# EasyEDA schematic 1-Schematic_testgarden.json
TITLE: moister; REV: 1.0; Date: 2021-08-10; Sheet: 1/1; Drawn By: Jack E; Company: Your Company
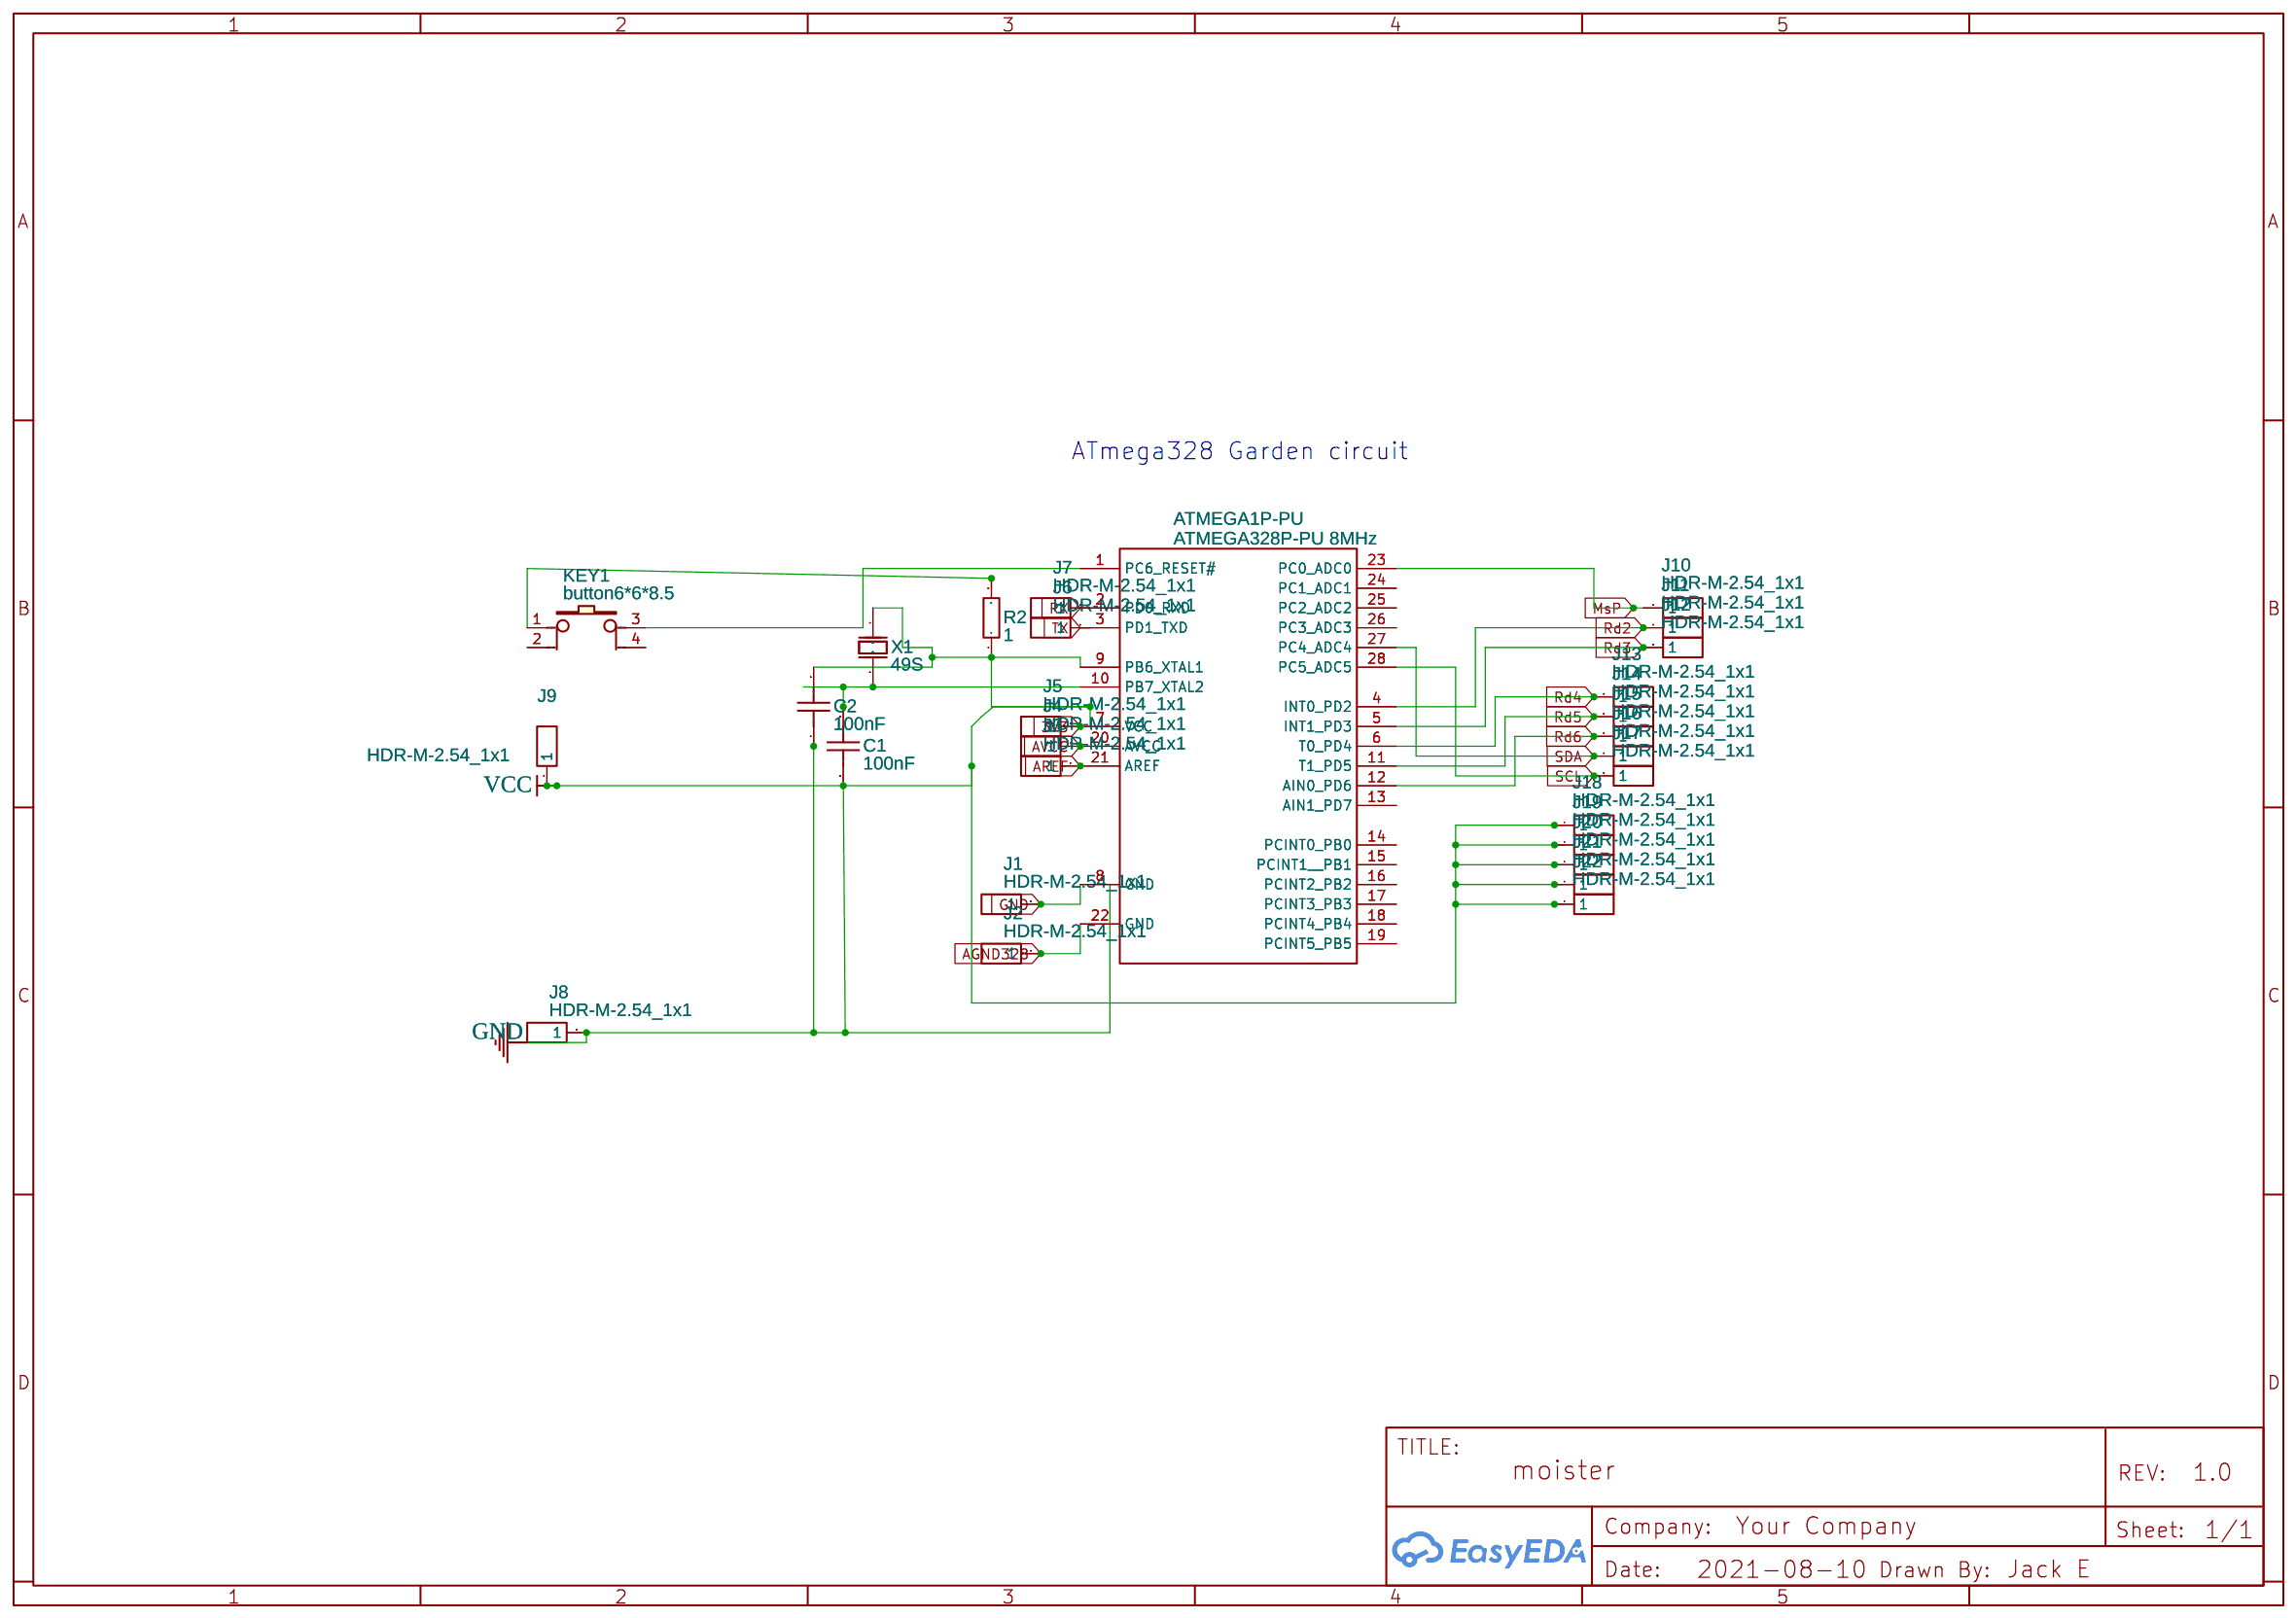
[diagram p0: schematic sheet]

## Parts
ATMEGA1P-PU  ATMEGA328P-PU 8MHz  [ATMEGA328P]
C1  100nF  [CAP-TH_L5.0-W4.0-P5.00-D1.0]
C2  100nF  [CAP-TH_L5.0-W4.0-P5.00-D1.0]
J1  HDR-M-2.54_1x1  [HDR-M-2.54_1X1]
J2  HDR-M-2.54_1x1  [HDR-M-2.54_1X1]
J3  HDR-M-2.54_1x1  [HDR-M-2.54_1X1]
J4  HDR-M-2.54_1x1  [HDR-M-2.54_1X1]
J5  HDR-M-2.54_1x1  [HDR-M-2.54_1X1]
J6  HDR-M-2.54_1x1  [HDR-M-2.54_1X1]
J7  HDR-M-2.54_1x1  [HDR-M-2.54_1X1]
J8  HDR-M-2.54_1x1  [HDR-M-2.54_1X1]
J9  HDR-M-2.54_1x1  [HDR-M-2.54_1X1]
J10  HDR-M-2.54_1x1  [HDR-M-2.54_1X1]
J11  HDR-M-2.54_1x1  [HDR-M-2.54_1X1]
J12  HDR-M-2.54_1x1  [HDR-M-2.54_1X1]
J13  HDR-M-2.54_1x1  [HDR-M-2.54_1X1]
J14  HDR-M-2.54_1x1  [HDR-M-2.54_1X1]
J15  HDR-M-2.54_1x1  [HDR-M-2.54_1X1]
J16  HDR-M-2.54_1x1  [HDR-M-2.54_1X1]
J17  HDR-M-2.54_1x1  [HDR-M-2.54_1X1]
J18  HDR-M-2.54_1x1  [HDR-M-2.54_1X1]
J19  HDR-M-2.54_1x1  [HDR-M-2.54_1X1]
J20  HDR-M-2.54_1x1  [HDR-M-2.54_1X1]
J21  HDR-M-2.54_1x1  [HDR-M-2.54_1X1]
J22  HDR-M-2.54_1x1  [HDR-M-2.54_1X1]
KEY1  button6*6*8.5  [KEY-TH_4P-L6.0-W6.0-P4.50]
R2  1  [RES-TH_BD4.5-L11.0-P15.00-D0.7]
X1  49S  [HC-49S_L11.0-W4.4-P4.88]

## Library data of the parts
ATMEGA1P-PU = ATMEGA328P-PU: sourceId: Oic6oiASL; Supplier: LCSC; Manufacturer: MICROCHIP; image: //image.lceda.cn/szlcsc/C33901.jpg; Contributor: waltertayler; Supplier Part: C33901
C1 C2 = CT4G-0805-2X1-63V-0.1μF-K: Supplier: LCSC; Supplier Part: C400087; Manufacturer: 火炬; Contributor: LCSC; JLCPCB Part Class: Extended Part
J1-J22 = HDR-M-2.54_1x1: Supplier Part: C81276; Supplier: LCSC; Contributor: LCEDA_Lib
KEY1 = button6*6*8.5: Supplier Part: C59980; Supplier: LCSC; Manufacturer: ReliaPro
R2 = EWWR0001J1R00T9: Supplier: LCSC; Supplier Part: C348836; Manufacturer: ResistorToday; Contributor: LCSC; JLCPCB Part Class: Extended Part
X1 = 49S DIP Crystal insulation film: Supplier: LCSC; Manufacturer: YXC; Supplier Part: C35018

## Nets
3V3: ATMEGA1P-PU.7(VCC) J5.1
AGND328: ATMEGA1P-PU.22(GND) J2.1
AVCC: ATMEGA1P-PU.20(AVCC) J4.1
GND: ATMEGA1P-PU.8(GND) ATMEGA1P-PU.9(PB6 XTAL1) C1.1 C2.1 C2.2 J1.1 J8.1 J9.1 J18.1 J19.1 J20.1 J21.1 J22.1 R2.1 X1.1(OSC1)
AREF: ATMEGA1P-PU.21(AREF) J3.1
MsP: ATMEGA1P-PU.23(PC0 ADC0) J10.1
Rd2: ATMEGA1P-PU.4(INT0 PD2) J11.1
Rd3: ATMEGA1P-PU.5(INT1 PD3) J12.1
Rd4: ATMEGA1P-PU.6(T0 PD4) J13.1
Rd5: ATMEGA1P-PU.11(T1 PD5) J14.1
Rd6: ATMEGA1P-PU.12(AIN0 PD6) J15.1
RX: ATMEGA1P-PU.2(PD0 RXD)
SCL: ATMEGA1P-PU.28(PC5 ADC5) J17.1
SDA: ATMEGA1P-PU.27(PC4 ADC4) J16.1
TX: ATMEGA1P-PU.3(PD1 TXD)
Net-(ATMEGA1P-PU-1): ATMEGA1P-PU.1(PC6 RESET#) KEY1.3
Net-(ATMEGA1P-PU-10): ATMEGA1P-PU.10(PB7 XTAL2) C1.2 X1.2(OSC2)
Net-(KEY1-1): KEY1.1 R2.2

Not connected (* = marked no-connect by the designer): ATMEGA1P-PU 13(AIN1 PD7) 14(PCINT0 PB0) 15(PCINT1  PB1) 16(PCINT2 PB2) 17(PCINT3 PB3) 18(PCINT4 PB4) 19(PCINT5 PB5) 24(PC1 ADC1) 25(PC2 ADC2) 26(PC3 ADC3); J6 1; J7 1; KEY1 2 4

## Notes on the sheet
- ATmega328 Garden circuit
